# EAGLE design tape-deck (EAGLE 9.6.2)
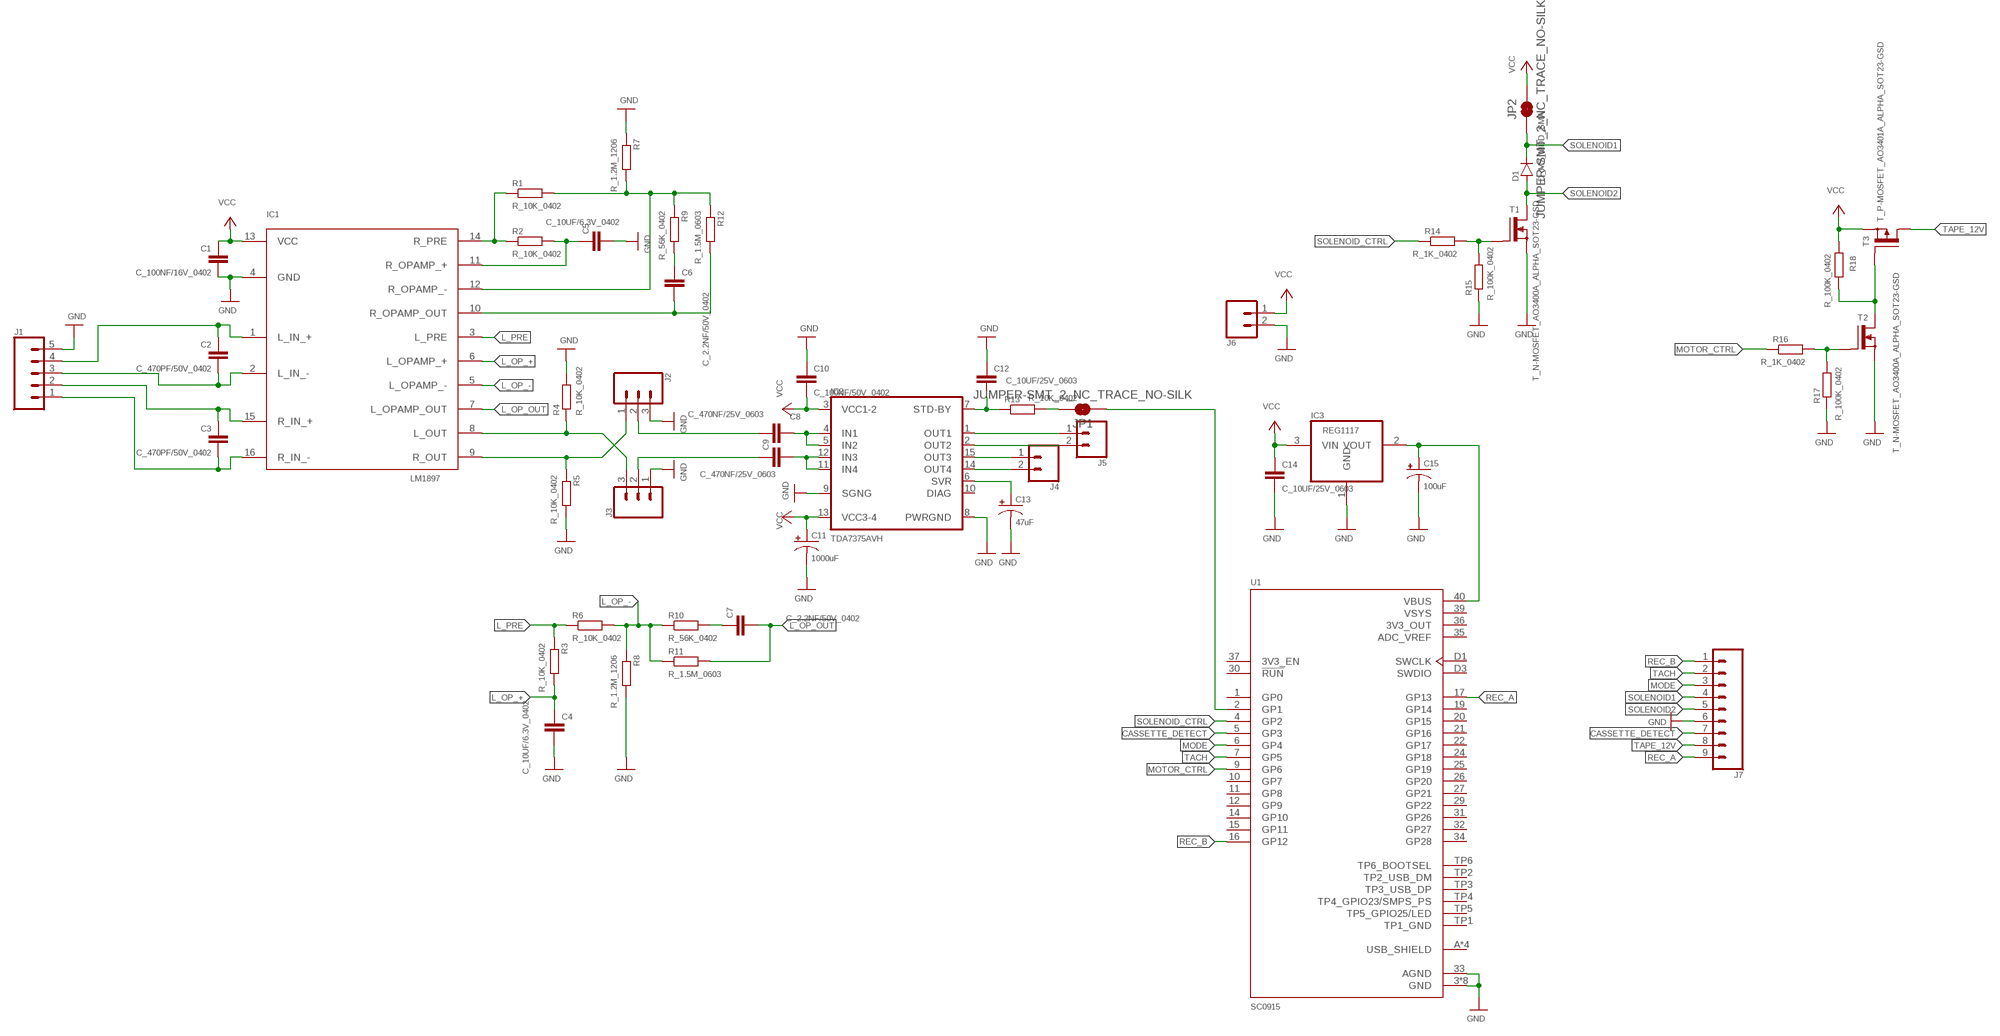
[diagram p0: schematic, sheet 1]

## Parts
C1  C_100NF/16V_0402  [C0402]
C2  C_470PF/50V_0402  [C0402]
C3  C_470PF/50V_0402  [C0402]
C4  C_10UF/6.3V_0402  [C0402]
C5  C_10UF/6.3V_0402  [C0402]
C6  C_2.2NF/50V_0402  [C0402]
C7  C_2.2NF/50V_0402  [C0402]
C8  C_470NF/25V_0603  [C0603]
C9  C_470NF/25V_0603  [C0603]
C10  C_100NF/50V_0402  [C0402]
C11  1000uF  CPOL-US140CLH-1014  [140CLH-1014]
C12  C_10UF/25V_0603  [C0603]
C13  47uF  CPOL-US140CLH-1014  [140CLH-1014]
C14  C_10UF/25V_0603  [C0603]
C15  100uF  CPOL-US140CLH-1014  [140CLH-1014]
D1  D_M7_MDD_SMA  [DO-214AC]
IC1  LM1897  [DIL16]
IC2  TDA7375AVH  [MULTIWATT-15H]
IC3  REG1117  [SOT223]
J1  CONN_05PTH_LONGPADS  [1X05_LONGPADS]
J2  CONN_03  [1X03]
J3  CONN_03  [1X03]
J4  CONN_02LOCK_LONGPADS  [1X02_LOCK_LONGPADS]
J5  CONN_02LOCK_LONGPADS  [1X02_LOCK_LONGPADS]
J6  CONN_02LOCK_LONGPADS  [1X02_LOCK_LONGPADS]
J7  CONN_09LONGPADS  [1X09_LONGPADS]
JP1  JUMPER-SMT_2_NC_TRACE_NO-SILK  [SMT-JUMPER_2_NC_TRACE_NO-SILK]
JP2  JUMPER-SMT_2_NC_TRACE_NO-SILK  [SMT-JUMPER_2_NC_TRACE_NO-SILK]
R1  R_10K_0402  [R0402]
R2  R_10K_0402  [R0402]
R3  R_10K_0402  [R0402]
R4  R_10K_0402  [R0402]
R5  R_10K_0402  [R0402]
R6  R_10K_0402  [R0402]
R7  R_1.2M_1206  [R1206]
R8  R_1.2M_1206  [R1206]
R9  R_56K_0402  [R0402]
R10  R_56K_0402  [R0402]
R11  R_1.5M_0603  [R0603]
R12  R_1.5M_0603  [R0603]
R13  R_10K_0402  [R0402]
R14  R_1K_0402  [R0402]
R15  R_100K_0402  [R0402]
R16  R_1K_0402  [R0402]
R17  R_100K_0402  [R0402]
R18  R_100K_0402  [R0402]
T1  T_N-MOSFET_AO3400A_ALPHA_SOT23-GSD  [SOT23]
T2  T_N-MOSFET_AO3400A_ALPHA_SOT23-GSD  [SOT23]
T3  T_P-MOSFET_AO3401A_ALPHA_SOT23-GSD  [SOT23]
U1  SC0915  [MODULE_SC0915]

## Nets
CASSETTE_DETECT: J7.7 U1.5(GP3)
GND: C1.2 C4.2 C5.2 C10.1 C11.- C12.1 C13.- C14.2 C15.- IC1.4(GND) IC2.8(PWRGND) IC2.9(SGNG) IC3.1(GND) J1.5 J2.3 J3.1 J6.2 J7.6 R4.2 R5.2 R7.1 R8.2 R15.1 R17.1 T1.2(S) T2.2(S) U1.3(GND) U1.8(GND) U1.13(GND) U1.18(GND) U1.23(GND) U1.28(GND) U1.33(AGND) U1.38(GND) U1.D2(GND)
L_OP_+: C4.1 IC1.6(L_OPAMP_+) R3.2
L_OP_-: IC1.5(L_OPAMP_-) R6.2 R8.1 R10.1 R11.1
L_OP_OUT: C7.2 IC1.7(L_OPAMP_OUT) R11.2
L_PRE: IC1.3(L_PRE) R3.1 R6.1
MODE: J7.3 U1.6(GP4)
MOTOR_CTRL: R16.1 U1.9(GP6)
N$1: R14.2 R15.2 T1.1(G)
N$2: R16.2 R17.2 T2.1(G)
N$3: R18.1 T2.3(D) T3.1(G)
N$4: C13.+ IC2.6(SVR)
N$5: C8.2 IC2.4(IN1) IC2.5(IN2)
N$6: C9.2 IC2.11(IN4) IC2.12(IN3)
N$7: JP1.2 R13.2
N$8: C2.1 IC1.1(L_IN_+) J1.4
N$9: C2.2 IC1.2(L_IN_-) J1.3
N$10: C3.1 IC1.15(R_IN_+) J1.2
N$11: C15.+ IC3.2(VOUT) U1.40(VBUS)
N$12: C3.2 IC1.16(R_IN_-) J1.1
N$13: JP1.1 U1.2(GP1)
N$14: C12.2 IC2.7(STD-BY) R13.1
N$15: IC2.1(OUT1) J5.1
N$16: IC2.2(OUT2) J5.2
N$17: IC2.15(OUT3) J4.1
N$18: IC2.14(OUT4) J4.2
N$19: IC1.14(R_PRE) R1.1 R2.1
N$20: C5.1 IC1.11(R_OPAMP_+) R2.2
N$21: IC1.12(R_OPAMP_-) R1.2 R7.2 R9.1 R12.1
N$22: C6.1 R9.2
N$23: C7.1 R10.2
N$24: C6.2 IC1.10(R_OPAMP_OUT) R12.2
N$25: IC1.8(L_OUT) J3.3 R4.1
N$26: IC1.9(R_OUT) J2.1 R5.1
N$27: C9.1 J3.2
N$28: C8.1 J2.2
REC_A: J7.9 U1.17(GP13)
REC_B: J7.1 U1.16(GP12)
SOLENOID1: D1.C J7.4 JP2.1
SOLENOID2: D1.A J7.5 T1.3(D)
SOLENOID_CTRL: R14.1 U1.4(GP2)
TACH: J7.2 U1.7(GP5)
TAPE_12V: J7.8 T3.3(D)
VCC: C1.1 C10.2 C11.+ C14.1 IC1.13(VCC) IC2.3(VCC1-2) IC2.13(VCC3-4) IC3.3(VIN) J6.1 JP2.2 R18.2 T3.2(S)
Unconnected: IC2.10(DIAG) U1.1(GP0) U1.10(GP7) U1.11(GP8) U1.12(GP9) U1.14(GP10) U1.15(GP11) U1.19(GP14) U1.20(GP15) U1.21(GP16) U1.22(GP17) U1.24(GP18) U1.25(GP19) U1.26(GP20) U1.27(GP21) U1.29(GP22) U1.30(!RUN) U1.31(GP26) U1.32(GP27) U1.34(GP28) U1.37(3V3_EN) U1.D1(SWCLK) U1.D3(SWDIO) U1.TP2(TP2_USB_DM) U1.TP3(TP3_USB_DP) U1.TP4(TP4_GPIO23/SMPS_PS) U1.TP5(TP5_GPIO25/LED) U1.TP6(TP6_BOOTSEL)

## Power pins joined to a net without a drawn wire
3V3_OUT: U1.36(3V3_OUT)
ADC_VREF: U1.35(ADC_VREF)
TP1_GND: U1.TP1(TP1_GND)
USB_SHIELD: U1.A(USB_SHIELD) U1.B(USB_SHIELD) U1.C(USB_SHIELD) U1.D(USB_SHIELD)
VSYS: U1.39(VSYS)

## Library data of the parts
C1 = JLC PCB Basic Parts_loc:C_: Capacitor General purpose SMD Capacitor; LCSC_DATASHEET: https://datasheet.lcsc.com/lcsc/1810191219_Samsung-Electro-Mechanics-CL05B104KO5NNNC_C1525.pdf; LCSC_PART: C1525; LCSC_ROTATION_CCW: 0; LCSC_STOCK: 7852677; PROPERTIES: 16V 100nF X7R ±10% 0402 ROHS
C2 C3 = JLC PCB Basic Parts_loc:C_: Capacitor General purpose SMD Capacitor; LCSC_DATASHEET: https://datasheet.lcsc.com/lcsc/1811141710_FH-Guangdong-Fenghua-Advanced-Tech-0402B471K500NT_C1537.pdf; LCSC_PART: C1537; LCSC_ROTATION_CCW: 0; LCSC_STOCK: 29330; PROPERTIES: 50V 470pF X7R ±10% 0402 ROHS
C4 C5 = JLC PCB Basic Parts_loc:C_: Capacitor General purpose SMD Capacitor; LCSC_DATASHEET: https://datasheet.lcsc.com/lcsc/1810191215_Samsung-Electro-Mechanics-CL05A106MQ5NUNC_C15525.pdf; LCSC_PART: C15525; LCSC_ROTATION_CCW: 0; LCSC_STOCK: 1727946; PROPERTIES: 6.3V 10uF X5R ±20% 0402 ROHS
C6 C7 = JLC PCB Basic Parts_loc:C_: Capacitor General purpose SMD Capacitor; LCSC_DATASHEET: https://datasheet.lcsc.com/lcsc/1811141710_FH-Guangdong-Fenghua-Advanced-Tech-0402B222K500NT_C1531.pdf; LCSC_PART: C1531; LCSC_ROTATION_CCW: 0; LCSC_STOCK: 188650; PROPERTIES: 50V 2.2nF X7R ±10% 0402 ROHS
C8 C9 = JLC PCB Basic Parts_loc:C_: Capacitor General purpose SMD Capacitor; LCSC_DATASHEET: https://datasheet.lcsc.com/lcsc/1810261513_Samsung-Electro-Mechanics-CL10B474KA8NNNC_C1623.pdf; LCSC_PART: C1623; LCSC_ROTATION_CCW: 0; LCSC_STOCK: 737714; PROPERTIES: 25V 470nF X7R ±10% 0603 ROHS
C10 = JLC PCB Basic Parts_loc:C_: Capacitor General purpose SMD Capacitor; LCSC_DATASHEET: https://datasheet.lcsc.com/lcsc/1810191222_Samsung-Electro-Mechanics-CL05B104KB54PNC_C307331.pdf; LCSC_PART: C307331; LCSC_ROTATION_CCW: 0; LCSC_STOCK: 959347; PROPERTIES: 50V 100nF X7R ±10% 0402 ROHS
C11 C13 C15 = adafruit:CPOL-US: POLARIZED CAPACITOR, American symbol
C12 C14 = JLC PCB Basic Parts_loc:C_: Capacitor General purpose SMD Capacitor; LCSC_DATASHEET: https://datasheet.lcsc.com/lcsc/1811110921_Samsung-Electro-Mechanics-CL10A106MA8NRNC_C96446.pdf; LCSC_PART: C96446; LCSC_ROTATION_CCW: 0; LCSC_STOCK: 119091; PROPERTIES: X5R 25V ±20% 10uF 0603 ROHS
D1 = JLC PCB Basic Parts_loc:D_: Diode; LCSC_DATASHEET: https://datasheet.lcsc.com/lcsc/1810311713_MDD-Microdiode-Electronics--M7_C95872.pdf; LCSC_PART: C95872; LCSC_ROTATION_CCW: 180; LCSC_STOCK: 1551081; PROPERTIES: 1A 5A@1kV 1kV 1.1V@1A SMA(DO-214AC) Diodes - General Purpose ROHS
IC1 = sonik:LM1897
IC2 = TDA7375AV:TDA7375AV: Check availability <https://pricing.snapeda.com/parts/TDA7375AV/STMicroelectronics/view-part?ref=eda>; AVAILABILITY: In Stock; CHECK_PRICES: https://www.snapeda.com/parts/TDA7375AV/STMicroelectronics/view-part/?ref=eda; DESCRIPTION: Amplifier IC 2-Channel (Stereo) or 4-Channel (Quad) Class AB 15-Multiwatt; MF: STMicroelectronics; MP: TDA7375AV; PACKAGE: Multiwatt-15 STMicroelectronics; PRICE: None; PURCHASE-URL: https://www.snapeda.com/api/url_track_click_mouser/?unipart_id=1098127&manufacturer=STMicroelectronics&part_name=TDA7375AV&search_term=tda7375; SNAPEDA_LINK: https://www.snapeda.com/parts/TDA7375AV/STMicroelectronics/view-part/?ref=snap
IC3 = burr-brown:REG1117: 800mA and 1A Low Dropout (LDO) Positive Regulator 1.8V, 2.5V, 2.85V, 3.3V, 5V, and Adj; MPN: REG1117; OC_FARNELL: 1097566; OC_NEWARK: 14P6981
J1 = SparkFun-Connectors:CONN_05: Multi connection point. Often used as Generic Header-pin footprint for 0.1 inch spaced/style header connections On any of the 0.1 inch spaced packages, you can populate with these: Break Away Headers - Straight <https://www.sparkfun.com/products/116> (PRT-00116) Break Away Male Headers - Right Angle <https://www.sparkfun.com/products/553> (PRT-00553) Female Headers <https://www.sparkfun.com/products/115> (PRT-00115) Break Away Headers - Machine Pin <https://www.sparkfun.com/products/117> (PRT-00117) Break Away Female Headers - Swiss Machine Pin <https://www.sparkfun.com/products/743> (PRT-00743) For SCREWTERMINALS and SPRING TERMINALS visit here: Screw Terimnals on SparkFun.com <https://www.sparkfun.com/search/results?term=Screw+Terminals> (5mm/3.5mm/2.54mm spacing) This device is also useful as a general connection point to wire up your design to another part of your project. Our various solder wires solder well into these plated through hole pads. Hook-Up Wire - Assortment (Stranded, 22 AWG) <https://www.sparkfun.com/products/11375> (PRT-11375) Hook-Up Wire - Assortment (Solid Core, 22 AWG) <https://www.sparkfun.com/products/11367> (PRT-11367) View the entire wire category on our website here <https://www.sparkfun.com/categories/141> Special notes: Molex polarized connector foot print use with SKU : PRT-08231 with associated crimp pins and housings. 1MM SMD Version SKU: PRT-10208
J2 J3 = SparkFun-Connectors:CONN_03: Multi connection point. Often used as Generic Header-pin footprint for 0.1 inch spaced/style header connections On any of the 0.1 inch spaced packages, you can populate with these: Break Away Headers - Straight <https://www.sparkfun.com/products/116> (PRT-00116) Break Away Male Headers - Right Angle <https://www.sparkfun.com/products/553> (PRT-00553) Female Headers <https://www.sparkfun.com/products/115> (PRT-00115) Break Away Headers - Machine Pin <https://www.sparkfun.com/products/117> (PRT-00117) Break Away Female Headers - Swiss Machine Pin <https://www.sparkfun.com/products/743> (PRT-00743) Stackable Header - 3 Pin (Female, 0.1") <https://www.sparkfun.com/products/13875> (PRT-13875) For SCREWTERMINALS and SPRING TERMINALS visit here: Screw Terimnals on SparkFun.com <https://www.sparkfun.com/search/results?term=Screw+Terminals> (5mm/3.5mm/2.54mm spacing) This device is also useful as a general connection point to wire up your design to another part of your project. Our various solder wires solder well into these plated through hole pads. Hook-Up Wire - Assortment (Stranded, 22 AWG) <https://www.sparkfun.com/products/11375> (PRT-11375) Hook-Up Wire - Assortment (Solid Core, 22 AWG) <https://www.sparkfun.com/products/11367> (PRT-11367) View the entire wire category on our website here <https://www.sparkfun.com/categories/141> Special notes: Molex polarized connector foot print use with SKU : PRT-08232 with associated crimp pins and housings.
J4-J6 = SparkFun-Connectors:CONN_02: Multi connection point. Often used as Generic Header-pin footprint for 0.1 inch spaced/style header connections On any of the 0.1 inch spaced packages, you can populate with these: Break Away Headers - Straight <https://www.sparkfun.com/products/116> (PRT-00116) Break Away Male Headers - Right Angle <https://www.sparkfun.com/products/553> (PRT-00553) Female Headers <https://www.sparkfun.com/products/115> (PRT-00115) Break Away Headers - Machine Pin <https://www.sparkfun.com/products/117> (PRT-00117) Break Away Female Headers - Swiss Machine Pin <https://www.sparkfun.com/products/743> (PRT-00743) For SCREWTERMINALS and SPRING TERMINALS visit here: Screw Terimnals on SparkFun.com <https://www.sparkfun.com/search/results?term=Screw+Terminals> (5mm/3.5mm/2.54mm spacing) This device is also useful as a general connection point to wire up your design to another part of your project. Our various solder wires solder well into these plated through hole pads. Hook-Up Wire - Assortment (Stranded, 22 AWG) <https://www.sparkfun.com/products/11375> (PRT-11375) Hook-Up Wire - Assortment (Solid Core, 22 AWG) <https://www.sparkfun.com/products/11367> (PRT-11367) View the entire wire category on our website here <https://www.sparkfun.com/categories/141> Special notes: Molex polarized connector foot print use with: PRT-08233 with associated crimp pins and housings. 2.54_SCREWTERM for use with PRT-10571. 3.5mm Screw Terminal footprints for PRT-08084 5mm Screw Terminal footprints for use with PRT-08432
J7 = SparkFun-Connectors:CONN_09: Multi connection point. Often used as Generic Header-pin footprint for 0.1 inch spaced/style header connections On any of the 0.1 inch spaced packages, you can populate with these: Break Away Headers - Straight <https://www.sparkfun.com/products/116> (PRT-00116) Break Away Male Headers - Right Angle <https://www.sparkfun.com/products/553> (PRT-00553) Female Headers <https://www.sparkfun.com/products/115> (PRT-00115) Break Away Headers - Machine Pin <https://www.sparkfun.com/products/117> (PRT-00117) Break Away Female Headers - Swiss Machine Pin <https://www.sparkfun.com/products/743> (PRT-00743) For SCREWTERMINALS and SPRING TERMINALS visit here: Screw Terimnals on SparkFun.com <https://www.sparkfun.com/search/results?term=Screw+Terminals> (5mm/3.5mm/2.54mm spacing) This device is also useful as a general connection point to wire up your design to another part of your project. Our various solder wires solder well into these plated through hole pads. Hook-Up Wire - Assortment (Stranded, 22 AWG) <https://www.sparkfun.com/products/11375> (PRT-11375) Hook-Up Wire - Assortment (Solid Core, 22 AWG) <https://www.sparkfun.com/products/11367> (PRT-11367) View the entire wire category on our website here <https://www.sparkfun.com/categories/141> Special notes: Molex polarized connector foot print use with SKU : PRT-08231 with associated crimp pins and housings. 1MM SMD Version SKU: PRT-10208 NOTES ON THE VARIANTS LOCK and LOCK_LONGPADS... This footprint was designed to help hold the alignment of a through-hole component (i.e. 6-pin header) while soldering it into place. You may notice that each hole has been shifted either up or down by 0.005 of an inch from it's more standard position (which is a perfectly straight line). This slight alteration caused the pins (the squares in the middle) to touch the edges of the holes. Because they are alternating, it causes a "brace" to hold the component in place. 0.005 has proven to be the perfect amount of "off-center" position when using our standard breakaway headers. Although looks a little odd when you look at the bare footprint, once you have a header in there, the alteration is very hard to notice. Also,if you push a header all the way into place, it is covered up entirely on the bottom side.
JP1 JP2 = SparkFun-Jumpers:JUMPER-SMT_2_NC_TRACE: Normally closed trace jumper This jumper has a trace between two pads so it's normally closed (NC). Use a razor knife to open the connection. For best results follow the IPC guidelines for cutting traces: Cutout at least 0.063 mm (0.005 in). Remove all loose material to clean up the cut area. Seal the cut with an approved epoxy. Reapply solder to reclose the connection.
R1-R6 R13 = JLC PCB Basic Parts_loc:R_: Resistor General purpose SMD Resistor; LCSC_DATASHEET: https://datasheet.lcsc.com/lcsc/2110260030_UNI-ROYAL-Uniroyal-Elec-0402WGF1002TCE_C25744.pdf; LCSC_PART: C25744; LCSC_ROTATION_CCW: 0; LCSC_STOCK: 11564817; PROPERTIES: ±1% 1/16W Thick Film Resistors 50V ±100ppm -55°C~+155°C 10kOhm 0402 ROHS
R7 R8 = JLC PCB Basic Parts_loc:R_: Resistor General purpose SMD Resistor; LCSC_DATASHEET: https://datasheet.lcsc.com/lcsc/2110252030_UNI-ROYAL-Uniroyal-Elec-1206W4F1204T5E_C22107.pdf; LCSC_PART: C22107; LCSC_ROTATION_CCW: 0; LCSC_STOCK: 80611; PROPERTIES: ±1% 1/4W Thick Film Resistors 200V ±100ppm -55°C~+155°C 1.2MOhm 1206 ROHS
R9 R10 = JLC PCB Basic Parts_loc:R_: Resistor General purpose SMD Resistor; LCSC_DATASHEET: https://datasheet.lcsc.com/lcsc/2110260030_UNI-ROYAL-Uniroyal-Elec-0402WGF5602TCE_C25796.pdf; LCSC_PART: C25796; LCSC_ROTATION_CCW: 0; LCSC_STOCK: 116685; PROPERTIES: ±1% 1/16W Thick Film Resistors 50V ±100ppm -55°C~+155°C 56kOhm 0402 ROHS
R11 R12 = JLC PCB Basic Parts_loc:R_: Resistor General purpose SMD Resistor; LCSC_DATASHEET: https://datasheet.lcsc.com/lcsc/2110251730_UNI-ROYAL-Uniroyal-Elec-0603WAF1504T5E_C4172.pdf; LCSC_PART: C4172; LCSC_ROTATION_CCW: 0; LCSC_STOCK: 18940; PROPERTIES: ±1% 1/10W Thick Film Resistors 75V ±100ppm -55°C~+155°C 1.5MOhm 0603 ROHS
R14 R16 = JLC PCB Basic Parts_loc:R_: Resistor General purpose SMD Resistor; LCSC_DATASHEET: https://datasheet.lcsc.com/lcsc/2110251730_UNI-ROYAL-Uniroyal-Elec-0402WGF1001TCE_C11702.pdf; LCSC_PART: C11702; LCSC_ROTATION_CCW: 0; LCSC_STOCK: 3758383; PROPERTIES: ±1% 1/16W Thick Film Resistors 50V ±100ppm -55°C~+155°C 1kOhm 0402 ROHS
R15 R17 R18 = JLC PCB Basic Parts_loc:R_: Resistor General purpose SMD Resistor; LCSC_DATASHEET: https://datasheet.lcsc.com/lcsc/2110260030_UNI-ROYAL-Uniroyal-Elec-0402WGF1003TCE_C25741.pdf; LCSC_PART: C25741; LCSC_ROTATION_CCW: 0; LCSC_STOCK: 423883; PROPERTIES: ±1% 1/16W Thick Film Resistors 50V ±100ppm -55°C~+155°C 100kOhm 0402 ROHS
T1 T2 = JLC PCB Basic Parts_loc:T_N-MOSFET_: Transistor N-MOSFET; LCSC_DATASHEET: https://datasheet.lcsc.com/lcsc/1811081213_Alpha---Omega-Semicon-AO3400A_C20917.pdf; LCSC_PART: C20917; LCSC_ROTATION_CCW: 180; LCSC_STOCK: 72607; PROPERTIES: 30V 5.7A 26.5mOhm@10V,5.7A 1.4W 1.5V@250A N Channel SOT-23-3L MOSFETs ROHS
T3 = JLC PCB Basic Parts_loc:T_P-MOSFET_: Transistor P-MOSFET; LCSC_DATASHEET: https://datasheet.lcsc.com/lcsc/1810171817_Alpha---Omega-Semicon-AO3401A_C15127.pdf; LCSC_PART: C15127; LCSC_ROTATION_CCW: 180; LCSC_STOCK: 67241; PROPERTIES: 30V 4A 44mOhm@10V,4.3A 1.4W 1.3V@250A P Channel SOT-23-3L MOSFETs ROHS
U1 = SC0915:SC0915: Check availability <https://pricing.snapeda.com/parts/SC0915/Raspberry%20Pi/view-part?ref=eda>; AVAILABILITY: In Stock; CHECK_PRICES: https://www.snapeda.com/parts/SC0915/Raspberry+Pi/view-part/?ref=eda; DESCRIPTION: Raspberry Pi Pico Embedded Dev Module | Raspberry Pi SC0915; MF: Raspberry Pi; MP: SC0915; PACKAGE: None; PRICE: None; PURCHASE-URL: https://www.snapeda.com/api/url_track_click_mouser/?unipart_id=6331605&manufacturer=Raspberry Pi&part_name=SC0915&search_term=raspberry pico; SNAPEDA_LINK: https://www.snapeda.com/parts/SC0915/Raspberry+Pi/view-part/?ref=snap

## Board
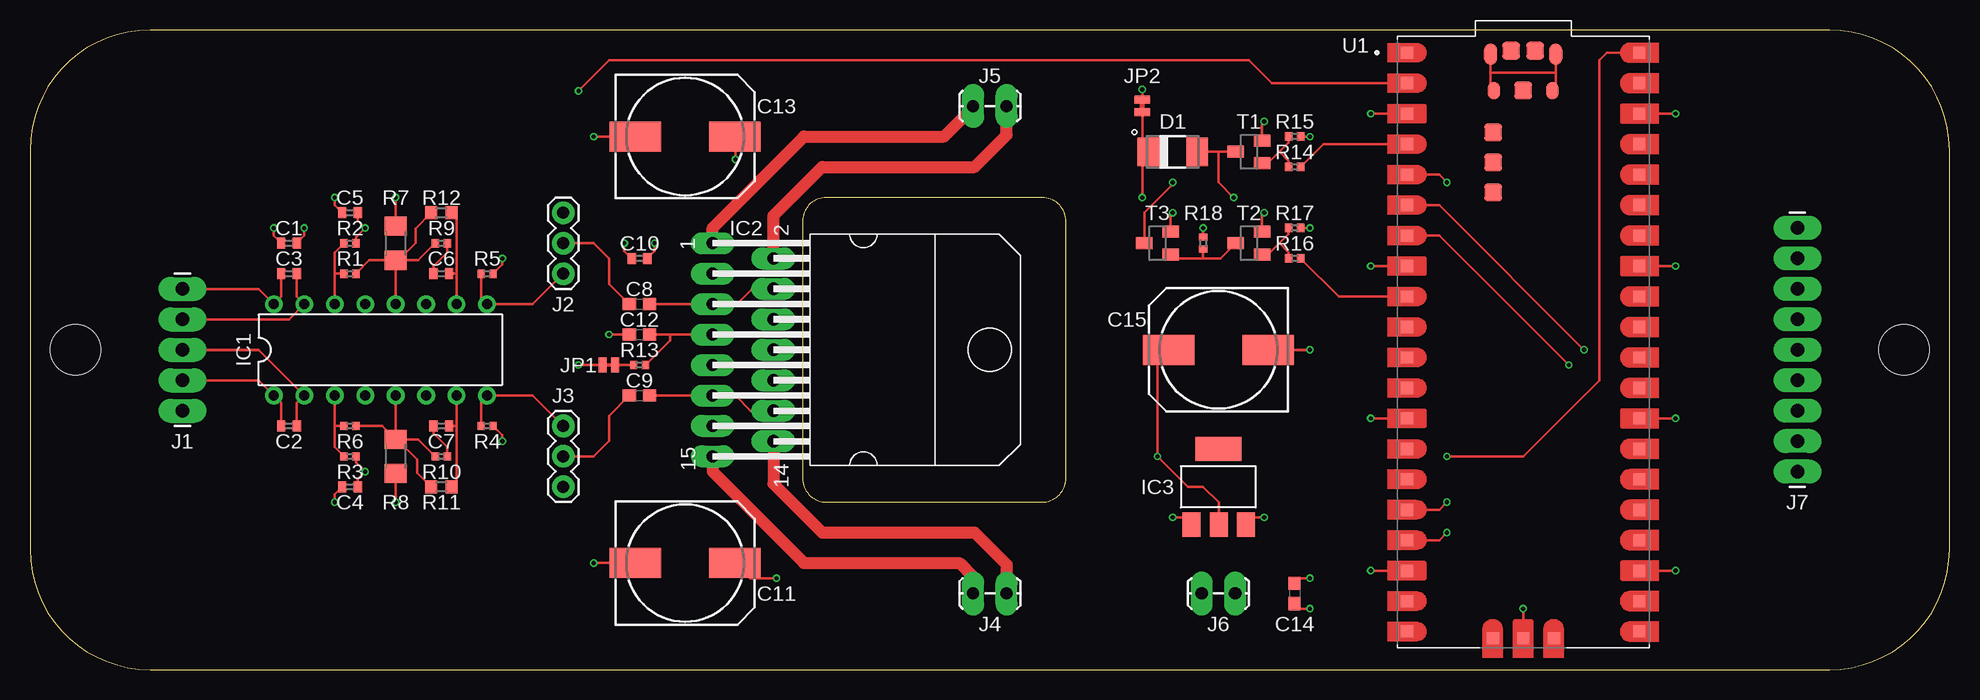
[diagram p1: board, top side]
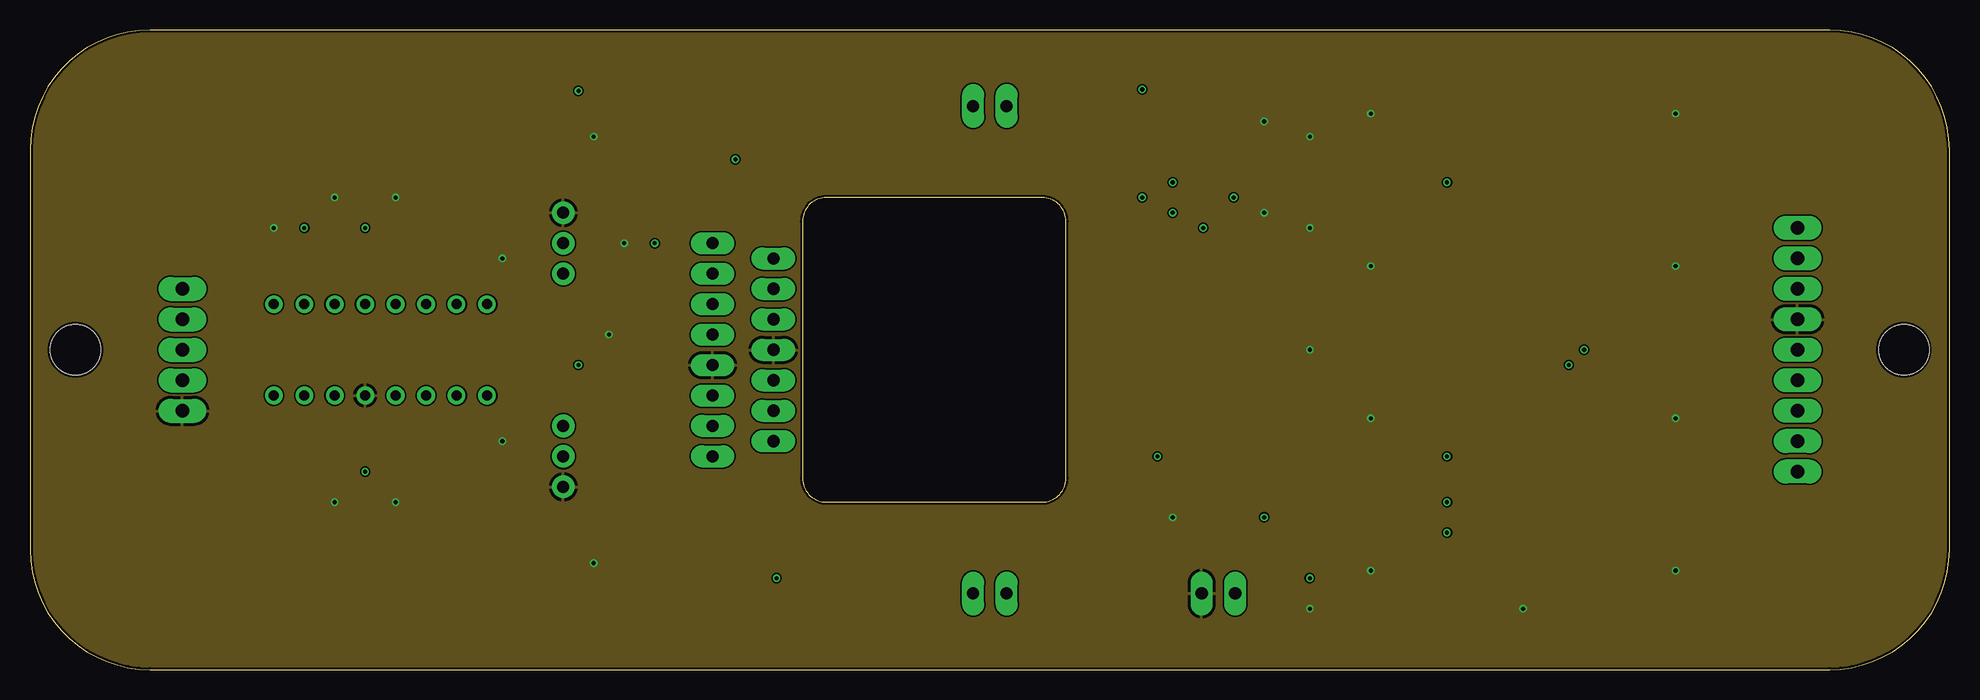
[diagram p2: board, inner layer Route2]
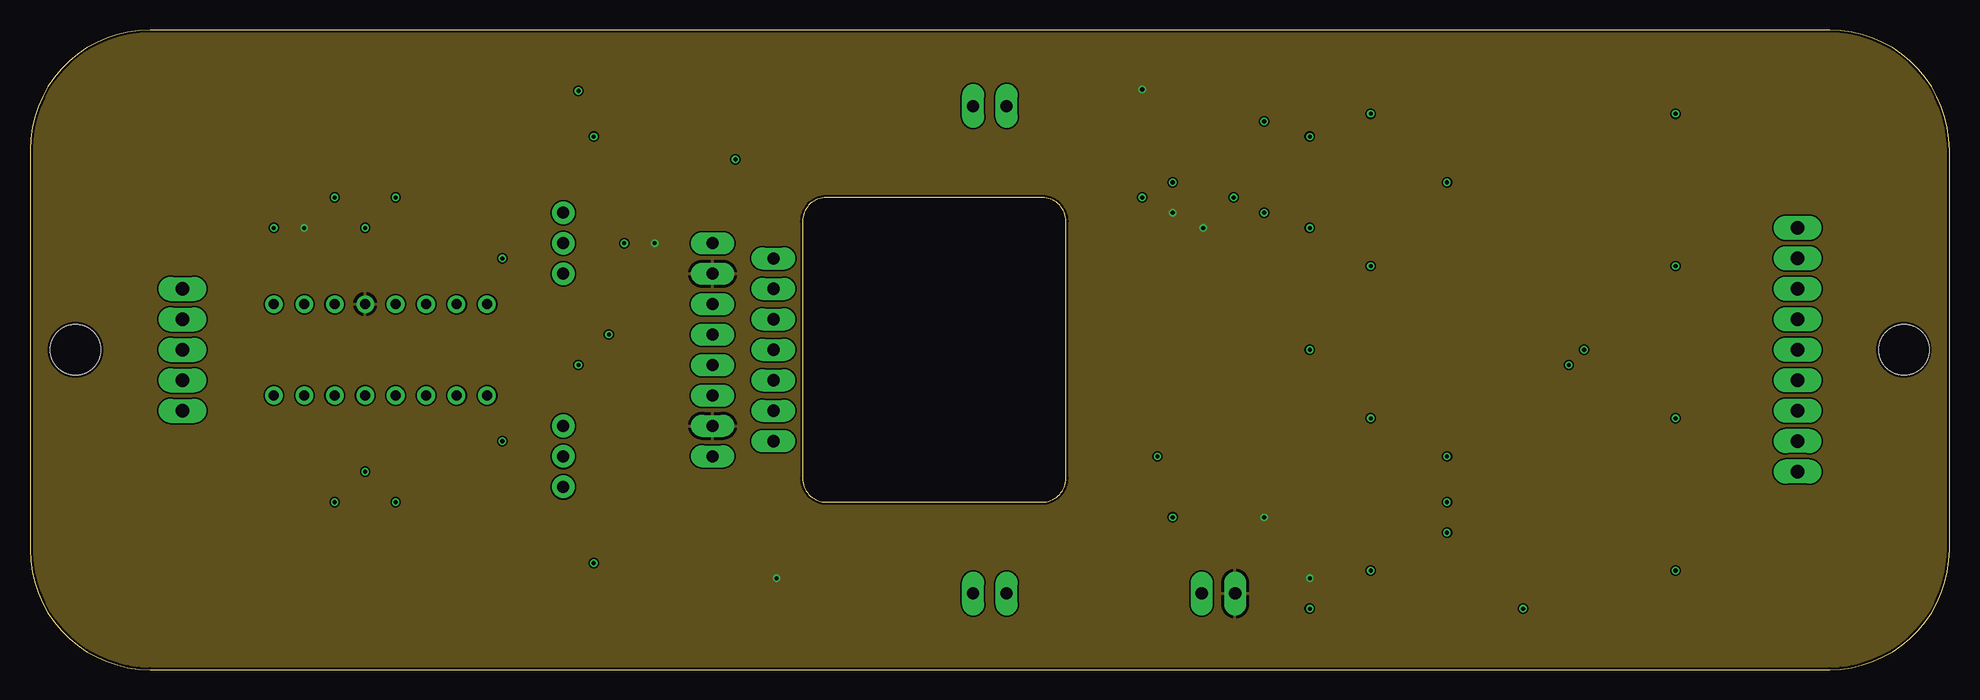
[diagram p3: board, inner layer Route15]
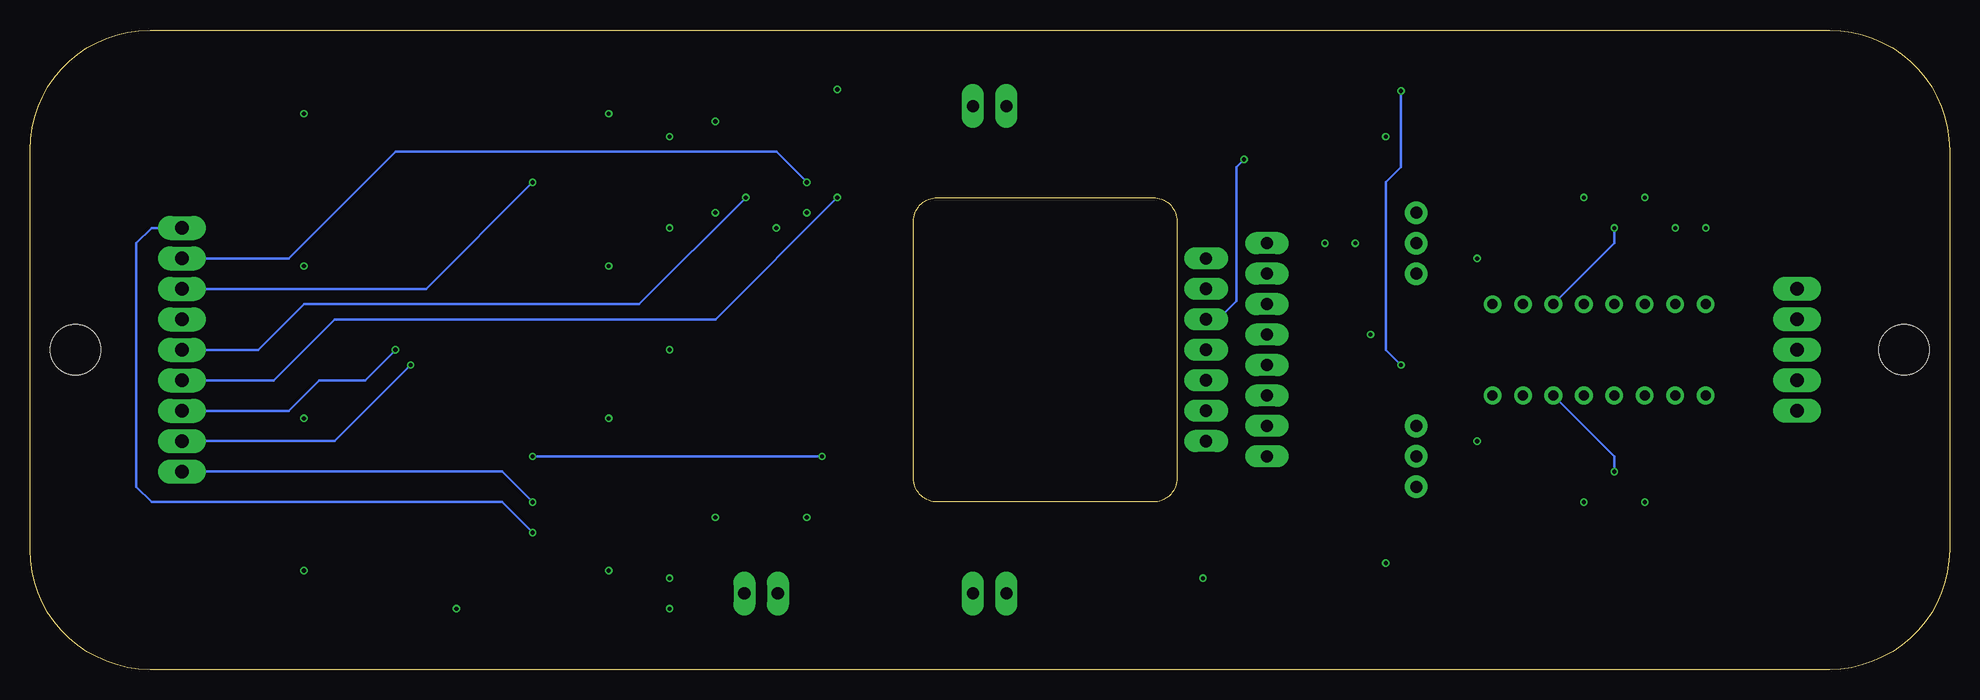
[diagram p4: board, bottom side, seen from below]

Size 160 x 53.34 mm. Coordinates in mm from the lower left corner, seen from the top.
Outline: 0,43.34 0,10 arc90 10,0 150,0 arc90 160,10 160,43.34 arc90 150,53.34 10,53.34 arc90 0,43.34
Outline: 64.39,37.37 64.39,15.97 arc90 66.39,13.97 84.36,13.97 arc90 86.36,15.97 86.36,37.37 arc90 84.36,39.37 66.39,39.37 arc90 64.39,37.37
Copper layers (1+2*15+16): Top 0.035mm / dielectric 0.2mm / Route2 0.0175mm / dielectric 1.065mm / Route15 0.0175mm / dielectric 0.2mm / Bottom 0.035mm
Design rules "jlcpcb-4layers *": minimum track width 3.5mil, minimum drill 0.2mm, track to track 5mil, track to pad 0.2mm, pad to pad 5mil, via to via 0.5mm, smd to smd 5mil, copper to edge 0.2mm, drill to drill 6mil, minimum pad ring 10mil, minimum via ring 0.13mm, stop-mask expansion 0.05mm, vias tented up to drill 16mil, thermal gap 10mil
Holes 4.2 mm at 3.8,26.67 156.2,26.67

### Footprints (pad centres in the part's own frame; a part is rotated, then mirrored left to right if it is on the bottom)
C0402 = smd 0.7 x 0.9: 1 -0.65,0; 2 0.65,0
C0603 = smd 1.1 x 1: 1 -0.85,0; 2 0.85,0
140CLH-1014 = smd 4.3 x 2.5: + 4.15,0; - -4.15,0
DO-214AC = smd 1.8 x 2.4: A 2.025,0; C -2.025,0
DIL16 = drill 0.813: 1 -8.89,-3.81; 2 -6.35,-3.81; 3 -3.81,-3.81; 4 -1.27,-3.81; 5 1.27,-3.81; 6 3.81,-3.81; 7 6.35,-3.81; 8 8.89,-3.81; 9 8.89,3.81; 10 6.35,3.81; 11 3.81,3.81; 12 1.27,3.81; 13 -1.27,3.81; 14 -3.81,3.81; 15 -6.35,3.81; 16 -8.89,3.81
MULTIWATT-15H = drill 1.016 pad 1.27 long: 1 -8.89,-5.08; 2 -7.62,0; 3 -6.35,-5.08; 4 -5.08,0; 5 -3.81,-5.08; 6 -2.54,0; 7 -1.27,-5.08; 8 0,0; 9 1.27,-5.08; 10 2.54,0; 11 3.81,-5.08; 12 5.08,0; 13 6.35,-5.08; 14 7.62,0; 15 8.89,-5.08
SOT223 = smd 1.499 x 2.007: 1 -2.261,-3.15; 2 0.025,-3.15; 3 2.311,-3.15 | smd 3.81 x 2.007: 4 0,3.15
1X05_LONGPADS = drill 1.118 pad 1.88 long: 1 0,0; 2 2.54,0; 3 5.08,0; 4 7.62,0; 5 10.16,0
1X03 = drill 1.016 pad 1.88: 1 0,0; 2 2.54,0; 3 5.08,0
1X02_LOCK_LONGPADS = drill 1.016 long: 1 -0.127,0; 2 2.667,0
1X09_LONGPADS = drill 1.118 pad 1.88 long: 1 0,0; 2 2.54,0; 3 5.08,0; 4 7.62,0; 5 10.16,0; 6 12.7,0; 7 15.24,0; 8 17.78,0; 9 20.32,0
SMT-JUMPER_2_NC_TRACE_NO-SILK = smd 0.66 x 1.27: 1 -0.521,0; 2 0.521,0
R0402 = smd 0.6 x 0.7: 1 -0.5,0; 2 0.5,0
R1206 = smd 1.6 x 1.803: 1 -1.422,0; 2 1.422,0
R0603 = smd 1 x 1.1: 1 -0.85,0; 2 0.85,0
SOT23 = smd 1.4 x 1: 1 -1.1,0.95; 2 -1.1,-0.95; 3 1.1,0
MODULE_SC0915 = smd 1 x 1: 1 -9.69,24.13; 2 -9.69,21.59; 3 -9.69,19.05; 4 -9.69,16.51; 5 -9.69,13.97; 6 -9.69,11.43; 7 -9.69,8.89; 8 -9.69,6.35; 9 -9.69,3.81; 10 -9.69,1.27; 11 -9.69,-1.27; 12 -9.69,-3.81; 13 -9.69,-6.35; 14 -9.69,-8.89; 15 -9.69,-11.43; 16 -9.69,-13.97; 17 -9.69,-16.51; 18 -9.69,-19.05; 19 -9.69,-21.59; 20 -9.69,-24.13; 21 9.69,-24.13; 22 9.69,-21.59; 23 9.69,-19.05; 24 9.69,-16.51; 25 9.69,-13.97; 26 9.69,-11.43; 27 9.69,-8.89; 28 9.69,-6.35; 29 9.69,-3.81; 30 9.69,-1.27; 31 9.69,1.27; 32 9.69,3.81; 33 9.69,6.35; 34 9.69,8.89; 35 9.69,11.43; 36 9.69,13.97; 37 9.69,16.51; 38 9.69,19.05; 39 9.69,21.59; 40 9.69,24.13; D1 -2.54,-24.7; D2 0,-24.7; D3 2.54,-24.7 | smd 1.1 x 1.8: A -2.725,24; B 2.725,24 | smd 1.05 x 1.45: C -2.425,20.97; D 2.425,20.97 | smd 1.5 x 1.5: TP1 0,21; TP2 1,24.3; TP3 -1,24.3; TP4 -2.5,17.5; TP5 -2.5,15; TP6 -2.5,12.5

### Placement (x,y rotation side)
C1  21.59,35.56 180 top
C2  21.59,20.32 0 top
C3  21.59,33.02 180 top
C4  26.67,15.24 180 top
C5  26.67,38.1 180 top
C6  34.29,33.02 0 top
C7  34.29,20.32 0 top
C8  50.8,30.48 0 top
C9  50.8,22.86 0 top
C10  50.8,34.29 0 top
C11  54.61,8.89 0 top
C12  50.8,27.94 0 top
C13  54.61,44.45 0 top
C14  105.41,6.35 270 top
C15  99.06,26.67 180 top
D1  95.25,43.18 0 top
IC1  29.21,26.67 0 top
IC2  61.98,26.67 270 top
IC3  99.06,15.24 0 top
J1  12.7,31.75 270 top
J2  44.45,33.02 90 top
J3  44.45,15.24 90 top
J4  78.74,6.35 0 top
J5  78.74,46.99 0 top
J6  100.33,6.35 180 top
J7  147.32,16.51 90 top
JP1  48.26,25.4 0 top
JP2  92.71,46.99 90 top
R1  26.67,33.02 0 top
R2  26.67,35.56 0 top
R3  26.67,17.78 0 top
R4  38.1,20.32 0 top
R5  38.1,33.02 0 top
R6  26.67,20.32 0 top
R7  30.48,35.56 270 top
R8  30.48,17.78 270 top
R9  34.29,35.56 0 top
R10  34.29,17.78 0 top
R11  34.29,15.24 0 top
R12  34.29,38.1 0 top
R13  50.8,25.4 180 top
R14  105.41,41.91 180 top
R15  105.41,44.45 180 top
R16  105.41,34.29 180 top
R17  105.41,36.83 180 top
R18  97.79,35.56 90 top
T1  101.6,43.18 180 top
T2  101.6,35.56 180 top
T3  93.98,35.56 180 top
U1  124.46,27.3 0 top

### Tracks (layer width: path | path; a pad name or v marks a point on that pad's centre or on a via)
CASSETTE_DETECT  (via drill 0.35)
  Top 0.203: v118.11,40.64 117.47,41.27 U1.5
  Bottom 0.203: J7.7 127,31.75 v118.11,40.64
GND  (via drill 0.35)
  Top 0.203: R7.1 v30.48,39.37 | C5.2 25.4,38.72 v25.4,39.37 | C1.2 20.32,36.18 v20.32,36.83 | C4.2 25.4,14.62 v25.4,13.97 | R8.2 v30.48,13.97 | R5.2 39.37,33.79 v39.37,34.29 | R4.2 39.37,19.55 v39.37,19.05 | C12.1 v48.26,27.94 | C10.1 49.53,34.91 v49.53,35.56 | C13.- v46.99,44.45 | C11.- v46.99,8.89 | U1.3 v111.76,46.35 | R15.1 v106.68,44.45 | T1.2 102.7,45.55 v102.87,45.72 | T2.2 102.7,37.93 v102.87,38.1 | R17.1 v106.68,36.83 | C15.- v106.68,26.67 | U1.8 v111.76,33.66 | U1.13 v111.76,20.95 | U1.18 v111.76,8.26 | C14.2 105.83,5.08 v106.68,5.08 | IC3.1 96.19,12.7 v95.25,12.7 | U1.38 v137.16,46.35 | U1.33 v137.16,33.66 | U1.28 v137.16,20.95 | U1.23 v137.16,8.26 | U1.D2 v124.46,5.08
  pour Route2: 0,0 160.02,0 160.02,53.34 0,53.34
L_OP_+  (via drill 0.35)
  Top 0.203: R3.2 27.17,17.28 v27.94,16.51 27.32,15.89 C4.1
  Bottom 0.203: IC1.6 27.94,17.78 v27.94,16.51
L_OP_-
  Top 0.203: IC1.5 R8.1 | R6.2 29.36,20.32 R8.1 | R10.1 32.37,19.2 R8.1 | R11.1 32.26,16.42 32.26,17.53 30.58,19.2 R8.1
L_OP_OUT
  Top 0.203: IC1.7 35.56,20.32 | 35.56,20.32 35.56,15.66 R11.2 | C7.2 35.56,20.32
L_PRE
  Top 0.203: IC1.3 25.4,20.32 | 25.4,20.32 25.4,18.55 R3.1 | R6.1 25.4,20.32
MODE  (via drill 0.35)
  Top 0.203: v129.54,26.67 117.47,38.73 U1.6
  Bottom 0.203: J7.3 138.43,21.59 135.89,24.13 132.08,24.13 v129.54,26.67
MOTOR_CTRL
  Top 0.203: U1.9 109.08,31.11 R16.1
N$1
  Top 0.203: T1.1 103.19,42.23 104.14,43.18 | R15.2 104.91,43.95 104.14,43.18 | R14.2 104.91,42.41 104.14,43.18
N$2
  Top 0.203: T2.1 103.19,34.61 104.14,35.56 | R17.2 104.91,36.33 104.14,35.56 | R16.2 104.91,34.79 104.14,35.56
N$3
  Top 0.203: T3.1 95.4,34.29 97.79,34.29 | T2.3 99.23,34.29 97.79,34.29 | R18.1 97.79,34.29
N$4  (via drill 0.35)
  Top 0.203: v58.8,42.55 58.8,44.41 C13.+
  Bottom 0.203: IC2.6 60.96,29.21 59.44,30.73 59.44,41.91 v58.8,42.55
N$5
  Top 0.203: C8.2 IC2.5 58.93,30.48 60.2,31.75 IC2.4
N$6
  Top 0.203: C9.2 IC2.11 58.8,22.86 60.07,21.59 IC2.12
N$7
  Top 0.203: R13.2 JP1.2
N$8
  Top 0.203: J1.4 19.05,24.13 IC1.1 20.94,22.24 C2.1
N$9
  Top 0.203: J1.3 19.05,26.67 IC1.2 22.24,22.24 C2.2
N$10
  Top 0.203: J1.2 21.59,29.21 IC1.15 22.24,31.1 C3.1
N$11  (via drill 0.35)
  Top 0.203: U1.40 131.44,51.44 130.81,50.8 130.81,24.13 124.46,17.78 v118.11,17.78 | C15.+ 93.98,25.74 v93.98,17.78 96.52,15.24 97.79,15.24 99.08,13.95 IC3.2
  Bottom 0.203: v118.11,17.78 v93.98,17.78
N$12
  Top 0.203: C3.2 20.94,31.1 IC1.16 19.05,31.75 J1.1
N$13  (via drill 0.35)
  Top 0.203: U1.2 103.5,48.9 101.6,50.8 48.26,50.8 v45.72,48.26 | v45.72,25.4 JP1.1
  Bottom 0.203: v45.72,48.26 45.72,41.91 46.99,40.64 46.99,26.67 v45.72,25.4
N$14
  Top 0.203: IC2.7 53.34,27.94 | 53.34,27.94 C12.2 | R13.1 53.34,27.44 53.34,27.94
N$15
  Top 0.203: 78.61,46.86 J5.1
  Top 1.016: IC2.1 56.9,36.83 64.52,44.45 76.2,44.45 78.61,46.86
N$16
  Top 1.016: IC2.2 61.98,37.85 66.04,41.91 78.74,41.91 81.41,44.58 J5.2
N$17
  Top 1.016: IC2.15 56.9,16.51 64.52,8.89 77.47,8.89 78.61,7.75 J4.1
N$18
  Top 1.016: IC2.14 61.98,15.49 66.04,11.43 78.74,11.43 81.41,8.76 J4.2
N$19
  Top 0.203: IC1.14 25.4,33.02 | 25.4,33.02 25.4,34.79 R2.1 | R1.1 25.4,33.02
N$20  (via drill 0.35)
  Top 0.203: C5.1 27.32,37.45 v27.94,36.83 27.17,36.06 R2.2
  Bottom 0.203: IC1.11 27.94,35.56 v27.94,36.83
N$21
  Top 0.203: R1.2 28.29,34.14 R7.2 | R9.1 32.37,34.14 R7.2 | R12.1 32.13,36.79 32.13,35.56 30.71,34.14 R7.2 | IC1.12 R7.2
N$22
  Top 0.203: C6.1 33.64,33.64 34.79,34.79 R9.2
N$23
  Top 0.203: C7.1 33.64,19.7 34.79,18.55 R10.2
N$24
  Top 0.203: IC1.10 35.56,33.02 | 35.56,33.02 35.56,37.68 R12.2 | C6.2 35.56,33.02
N$25
  Top 0.203: R4.1 37.6,22.36 IC1.8 41.91,22.86 J3.3
N$26
  Top 0.203: R5.1 37.6,30.98 IC1.9 41.91,30.48 J2.1
N$27
  Top 0.203: J3.2 46.99,17.78 48.26,19.05 48.26,21.17 C9.1
N$28
  Top 0.203: J2.2 46.99,35.56 48.26,34.29 48.26,32.17 C8.1
REC_A  (via drill 0.35)
  Top 0.203: v118.11,11.43 117.47,10.79 U1.17
  Bottom 0.203: J7.9 149.86,36.83 151.13,35.56 151.13,15.24 149.86,13.97 120.65,13.97 v118.11,11.43
REC_B  (via drill 0.35)
  Top 0.203: v118.11,13.97 117.47,13.34 U1.16
  Bottom 0.203: J7.1 120.65,16.51 v118.11,13.97
SOLENOID1  (via drill 0.35)
  Top 0.203: JP2.1 92.71,43.7 D1.C 92.71,42.66 v92.71,39.37
  Bottom 0.203: J7.4 139.7,24.13 134.62,29.21 102.87,29.21 v92.71,39.37
SOLENOID2  (via drill 0.35)
  Top 0.203: T1.3 99.06,43.18 | 99.06,43.18 D1.A | v100.33,39.37 99.06,40.64 99.06,43.18
  Bottom 0.203: J7.5 140.97,26.67 137.16,30.48 109.22,30.48 v100.33,39.37
SOLENOID_CTRL
  Top 0.203: U1.4 107.81,43.81 R14.1
TACH  (via drill 0.35)
  Top 0.203: v128.27,25.4 117.47,36.2 U1.7
  Bottom 0.203: J7.2 134.62,19.05 v128.27,25.4
TAPE_12V  (via drill 0.35)
  Top 0.203: v95.25,40.64 95.25,40.47 92.88,38.1 T3.3
  Bottom 0.203: J7.8 138.43,34.29 129.54,43.18 97.79,43.18 v95.25,40.64
USB_SHIELD
  Top 0.203: U1.A 121.73,49.78 | U1.C 121.73,48.58 121.73,49.53 121.73,49.78 | U1.D 127.19,48.58 127.19,49.78 | 127.19,49.78 U1.B | 121.73,49.78 127.19,49.78
VCC  (via drill 0.35)
  Top 0.203: C1.1 22.86,36.18 v22.86,36.83 | C10.2 52.07,34.91 v52.07,35.56 | v62.23,7.62 60.03,7.62 C11.+ | JP2.2 v92.71,48.39 | T3.2 95.08,37.93 v95.25,38.1 | R18.2 v97.79,36.83 | C14.1 105.83,7.62 v106.68,7.62 | IC3.3 101.98,12.7 v102.87,12.7
  pour Route15: 0,0 160.02,0 160.02,53.34 0,53.34

### Text on the board
tValues: + | + | +